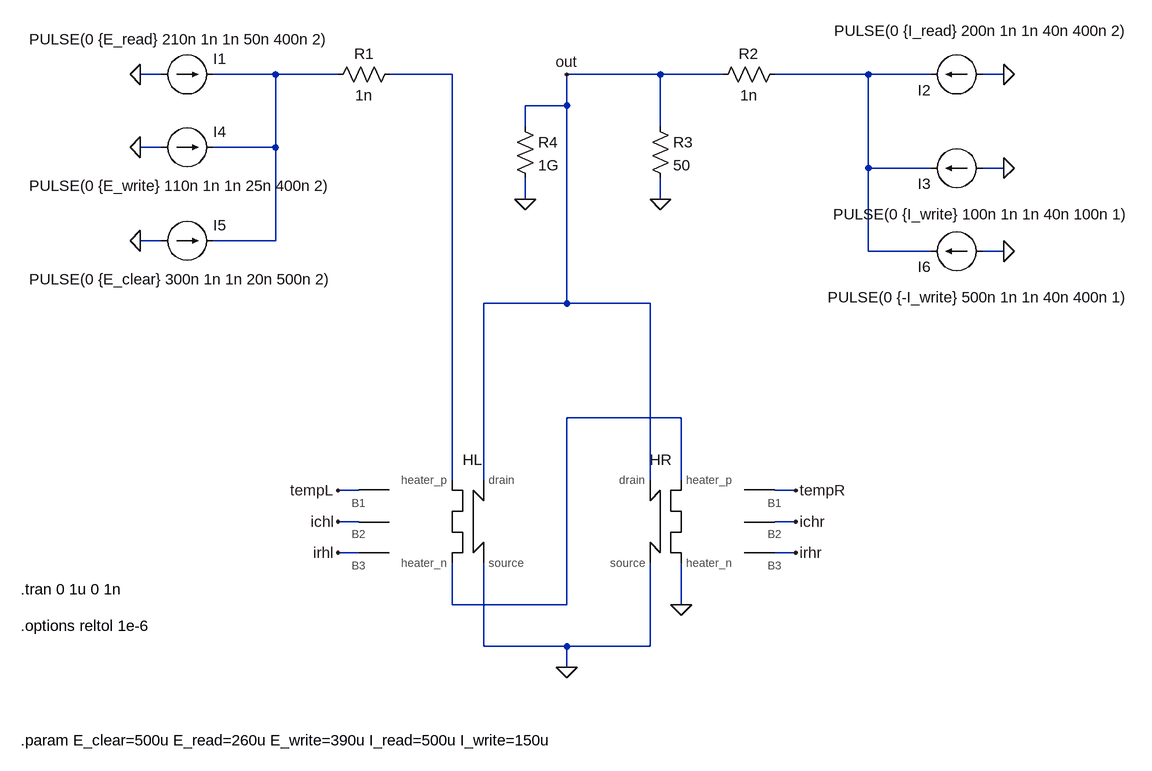
[diagram p0: schematic nmem_cell.asc]
nmem_cell.asc, the LTspice schematic file:
Version 4.1
SHEET 1 2708 1228
WIRE -400 32 -432 32
WIRE -224 32 -320 32
WIRE -128 32 -224 32
WIRE 48 32 -48 32
WIRE 368 32 224 32
WIRE 464 32 368 32
WIRE 688 32 544 32
WIRE 784 32 688 32
WIRE 896 32 864 32
WIRE 224 80 224 32
WIRE 224 80 160 80
WIRE 160 112 160 80
WIRE 368 112 368 32
WIRE -400 144 -432 144
WIRE -224 144 -224 32
WIRE -224 144 -320 144
WIRE 688 176 688 32
WIRE 784 176 688 176
WIRE 896 176 864 176
WIRE 160 224 160 192
WIRE 368 224 368 192
WIRE -400 288 -432 288
WIRE -224 288 -224 144
WIRE -224 288 -320 288
WIRE 688 304 688 176
WIRE 784 304 688 304
WIRE 896 304 864 304
WIRE 224 384 224 80
WIRE 224 384 96 384
WIRE 352 384 224 384
WIRE 400 560 224 560
WIRE 48 656 48 32
WIRE 96 656 96 384
WIRE 352 656 352 384
WIRE 400 656 400 560
WIRE -96 672 -128 672
WIRE 576 672 544 672
WIRE -96 720 -128 720
WIRE 576 720 544 720
WIRE -96 768 -128 768
WIRE 576 768 544 768
WIRE 48 848 48 784
WIRE 224 848 224 560
WIRE 224 848 48 848
WIRE 400 848 400 784
WIRE 96 912 96 784
WIRE 224 912 96 912
WIRE 352 912 352 784
WIRE 352 912 224 912
WIRE 224 944 224 912
FLAG -432 32 0
FLAG 896 176 0
FLAG 224 32 out
FLAG 224 944 0
FLAG 400 848 0
FLAG 896 32 0
FLAG -432 144 0
FLAG 368 224 0
FLAG -128 768 irhl
FLAG 576 768 irhr
FLAG -128 720 ichl
FLAG 576 720 ichr
FLAG -128 672 tempL
FLAG -432 288 0
FLAG 896 304 0
FLAG 160 224 0
FLAG 576 672 tempR
SYMBOL current -400 32 R270
WINDOW 0 24 80 VRight 2
WINDOW 3 54 -203 VRight 2
WINDOW 123 0 0 Left 0
WINDOW 39 0 0 Left 0
SYMATTR InstName I1
SYMATTR Value PULSE(0 {E_read} 210n 1n 1n 50n 400n 2)
SYMBOL current 864 32 R90
WINDOW 0 24 80 VRight 2
WINDOW 3 -67 -228 VRight 2
WINDOW 123 0 0 Left 0
WINDOW 39 0 0 Left 0
SYMATTR InstName I2
SYMATTR Value PULSE(0 {I_read} 200n 1n 1n 40n 400n 2)
SYMBOL current 864 176 R90
WINDOW 0 24 80 VRight 2
WINDOW 3 71 -229 VRight 2
WINDOW 123 0 0 Left 0
WINDOW 39 0 0 Left 0
SYMATTR InstName I3
SYMATTR Value PULSE(0 {I_write} 100n 1n 1n 40n 100n 1)
SYMBOL current -400 144 R270
WINDOW 0 24 80 VRight 2
WINDOW 3 -59 -203 VRight 2
WINDOW 123 0 0 Left 0
WINDOW 39 0 0 Left 0
SYMATTR InstName I4
SYMATTR Value PULSE(0 {E_write} 110n 1n 1n 25n 400n 2)
SYMBOL res -144 48 R270
WINDOW 0 32 56 VTop 2
WINDOW 3 0 56 VBottom 2
SYMATTR InstName R1
SYMATTR Value 1n
SYMBOL res 560 16 R90
WINDOW 0 0 56 VBottom 2
WINDOW 3 32 56 VTop 2
SYMATTR InstName R2
SYMATTR Value 1n
SYMBOL res 352 96 R0
SYMATTR InstName R3
SYMATTR Value 50
SYMBOL hTron_behavioral 112 720 R0
SYMATTR SpiceLine width_c=100n, width_h=100n, thick_c=23.6n, length_c=870n, R_h=300, Tsub=1.3, Tc=12.5, sheetRes=77.9, eta=3, Jsw_tilde=163G, Isupp_tilde=500u, Jconstr=100G, tau_on=5n, ICh_bias_on=100u, Ih_bias_on=530u const_width=100n substrate_temp=1.3 const_length=870n heater_resistance=300
SYMATTR InstName HL
SYMBOL hTron_behavioral 336 720 M0
SYMATTR SpiceLine width_c=300n, width_h=100n, thick_c=23.6n, length_c=4.11u, R_h=300, Tsub=1.3, Tc=12.5, sheetRes=77.9, eta=3, Jsw_tilde=163G, Isupp_tilde=500u, Jconstr=100G, tau_on=5n, ICh_bias_on=100u, Ih_bias_on=530u const_width=300n const_length=4.11u substrate_temp=1.3 heater_resistance=300
SYMATTR InstName HR
SYMBOL current -400 288 R270
WINDOW 0 24 80 VRight 2
WINDOW 3 -59 -203 VRight 2
WINDOW 123 0 0 Left 0
WINDOW 39 0 0 Left 0
SYMATTR InstName I5
SYMATTR Value PULSE(0 {E_clear} 300n 1n 1n 20n 500n 2)
SYMBOL current 864 304 R90
WINDOW 0 24 80 VRight 2
WINDOW 3 71 -229 VRight 2
WINDOW 123 0 0 Left 0
WINDOW 39 0 0 Left 0
SYMATTR InstName I6
SYMATTR Value PULSE(0 {-I_write} 500n 1n 1n 40n 400n 1)
SYMBOL res 144 96 R0
SYMATTR InstName R4
SYMATTR Value 1G
TEXT -616 1056 Left 2 !.param E_clear=500u E_read=260u E_write=390u I_read=500u I_write=150u
TEXT -616 824 Left 2 !.tran 0 1u 0 1n
TEXT -616 880 Left 2 !.options reltol 1e-6

The netlist it stands for:
* nmem_cell.asc
I1 0 N001 PULSE(0 {E_read} 210n 1n 1n 50n 400n 2)
I2 0 N003 PULSE(0 {I_read} 200n 1n 1n 40n 400n 2)
I3 0 N003 PULSE(0 {I_write} 100n 1n 1n 40n 100n 1)
I4 0 N001 PULSE(0 {E_write} 110n 1n 1n 25n 400n 2)
R1 N001 N002 1n
R2 N003 out 1n
R3 out 0 50
X§HL N002 N004 out 0 tempL ichl irhl hTron_behav width_c=100n, width_h=100n, thick_c=23.6n, length_c=870n, R_h=300, Tsub=1.3, Tc=12.5, sheetRes=77.9, eta=3, Jsw_tilde=163G, Isupp_tilde=500u, Jconstr=100G, tau_on=5n, ICh_bias_on=100u, Ih_bias_on=530u const_width=100n substrate_temp=1.3 const_length=870n heater_resistance=300  ; pins heater_p heater_n drain source B1 B2 B3
X§HR N004 0 out 0 tempR ichr irhr hTron_behav width_c=300n, width_h=100n, thick_c=23.6n, length_c=4.11u, R_h=300, Tsub=1.3, Tc=12.5, sheetRes=77.9, eta=3, Jsw_tilde=163G, Isupp_tilde=500u, Jconstr=100G, tau_on=5n, ICh_bias_on=100u, Ih_bias_on=530u const_width=300n const_length=4.11u substrate_temp=1.3 heater_resistance=300  ; pins heater_p heater_n drain source B1 B2 B3
I5 0 N001 PULSE(0 {E_clear} 300n 1n 1n 20n 500n 2)
I6 0 N003 PULSE(0 {-I_write} 500n 1n 1n 40n 400n 1)
R4 out 0 1G
.param E_clear=500u E_read=260u E_write=390u I_read=500u I_write=150u
.tran 0 1u 0 1n
.options reltol 1e-6
.lib hTron_behavioral.lib
.backanno
.end